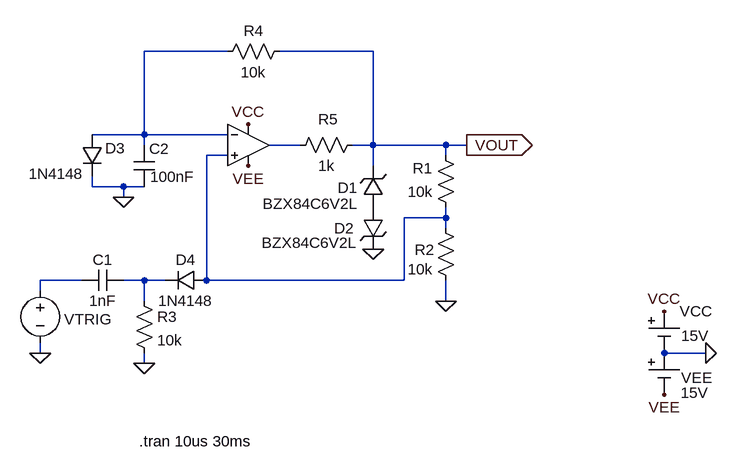
[diagram p0: schematic OpAmpMonstabile.asc]
OpAmpMonstabile.asc, the LTspice schematic file:
Version 4
SHEET 1 960 888
WIRE 208 224 80 224
WIRE 432 224 288 224
WIRE 80 352 80 224
WIRE 80 352 0 352
WIRE 208 352 80 352
WIRE 80 368 80 352
WIRE 320 368 272 368
WIRE 432 368 432 224
WIRE 432 368 400 368
WIRE 544 368 432 368
WIRE 576 368 544 368
WIRE 208 384 176 384
WIRE 544 384 544 368
WIRE 432 400 432 368
WIRE 0 432 0 416
WIRE 48 432 0 432
WIRE 80 432 48 432
WIRE 48 448 48 432
WIRE 544 480 544 464
WIRE 544 480 480 480
WIRE 544 496 544 480
WIRE -16 576 -80 576
WIRE 80 576 48 576
WIRE 112 576 80 576
WIRE 176 576 176 384
WIRE 480 576 480 480
WIRE 480 576 176 576
WIRE -80 592 -80 576
WIRE 80 608 80 576
WIRE 544 608 544 576
WIRE -80 688 -80 672
WIRE 944 688 880 688
WIRE 80 704 80 688
FLAG 544 608 0
FLAG 432 528 0
FLAG 576 368 VOUT
IOPIN 576 368 Out
FLAG 240 336 VCC
FLAG 240 400 VEE
FLAG 880 624 VCC
FLAG 880 752 VEE
FLAG 944 688 0
FLAG 48 448 0
FLAG -80 688 0
FLAG 80 704 0
SYMBOL Opamps/UniversalOpamp2 240 368 R0
WINDOW 0 16 -32 Invisible 2
SYMATTR InstName U1
SYMBOL res 560 480 R180
WINDOW 0 36 76 Left 2
WINDOW 3 36 40 Left 2
SYMATTR InstName R1
SYMATTR Value 10k
SYMBOL res 560 592 R180
WINDOW 0 33 63 Left 2
WINDOW 3 36 33 Left 2
SYMATTR InstName R2
SYMATTR Value 10k
SYMBOL res 304 384 R270
WINDOW 0 40 59 VTop 2
WINDOW 3 0 56 VBottom 2
SYMATTR InstName R5
SYMATTR Value 1k
SYMBOL Misc/cell 880 624 R0
WINDOW 3 26 37 Left 2
SYMATTR Value 15V
SYMATTR InstName VCC
SYMBOL Misc/cell 880 688 R0
WINDOW 0 26 38 Left 2
WINDOW 3 25 61 Left 2
SYMATTR InstName VEE
SYMATTR Value 15V
SYMBOL zener 448 464 R180
WINDOW 0 40 30 Left 2
WINDOW 3 39 6 Left 2
SYMATTR InstName D1
SYMATTR Value BZX84C6V2L
SYMBOL zener 416 464 R0
WINDOW 0 -44 32 Left 2
WINDOW 3 -155 54 Left 2
SYMATTR InstName D2
SYMATTR Value BZX84C6V2L
SYMBOL res 304 208 R90
WINDOW 0 0 56 VBottom 2
WINDOW 3 32 56 VTop 2
SYMATTR InstName R4
SYMATTR Value 10k
SYMBOL cap 96 432 R180
WINDOW 0 -22 58 Left 2
WINDOW 3 -62 15 Left 2
SYMATTR InstName C2
SYMATTR Value 100nF
SYMBOL cap 48 560 R90
WINDOW 0 0 32 VBottom 2
WINDOW 3 32 32 VTop 2
SYMATTR InstName C1
SYMATTR Value 1nF
SYMBOL voltage -80 576 R0
WINDOW 0 37 60 Left 2
WINDOW 3 37 82 Invisible 2
SYMATTR InstName VTRIG
SYMATTR Value PULSE(0 5 1n 1n 1n 10ms 20ms 3)
SYMATTR Value2 AC 1
SYMBOL res 64 592 R0
SYMATTR InstName R3
SYMATTR Value 10k
SYMBOL diode 176 560 R90
WINDOW 0 0 32 VBottom 2
WINDOW 3 32 32 VTop 2
SYMATTR InstName D4
SYMATTR Value 1N4148
SYMBOL diode -16 352 R0
WINDOW 0 36 21 Left 2
WINDOW 3 -82 60 Left 2
SYMATTR InstName D3
SYMATTR Value 1N4148
TEXT 72 824 Left 2 !.tran 10us 30ms

The netlist it stands for:
* OpAmpMonstabile.asc
XU1 N003 N001 VCC VEE N002 level.2 Avol=1Meg GBW=10Meg Slew=10Meg ilimit=25m rail=0 Vos=0 phimargin=45 en=0 enk=0 in=0 ink=0 Rin=500Meg  ; pins IN+ IN- V+ V- OUT
R1 N003 VOUT 10k
R2 0 N003 10k
R5 N002 VOUT 1k
VCC VCC 0 15V
VEE 0 VEE 15V
D1 P001 VOUT BZX84C6V2L
D2 P001 0 BZX84C6V2L
R4 VOUT N001 10k
C2 0 N001 100nF
C1 N005 N004 1nF
VTRIG N004 0 PULSE(0 5 1n 1n 1n 10ms 20ms 3) AC 1
R3 N005 0 10k
D4 N003 N005 1N4148
D3 N001 0 1N4148
.model D D
.lib standard.dio
.tran 10us 30ms
.lib UniversalOpamps2.sub
.backanno
.end